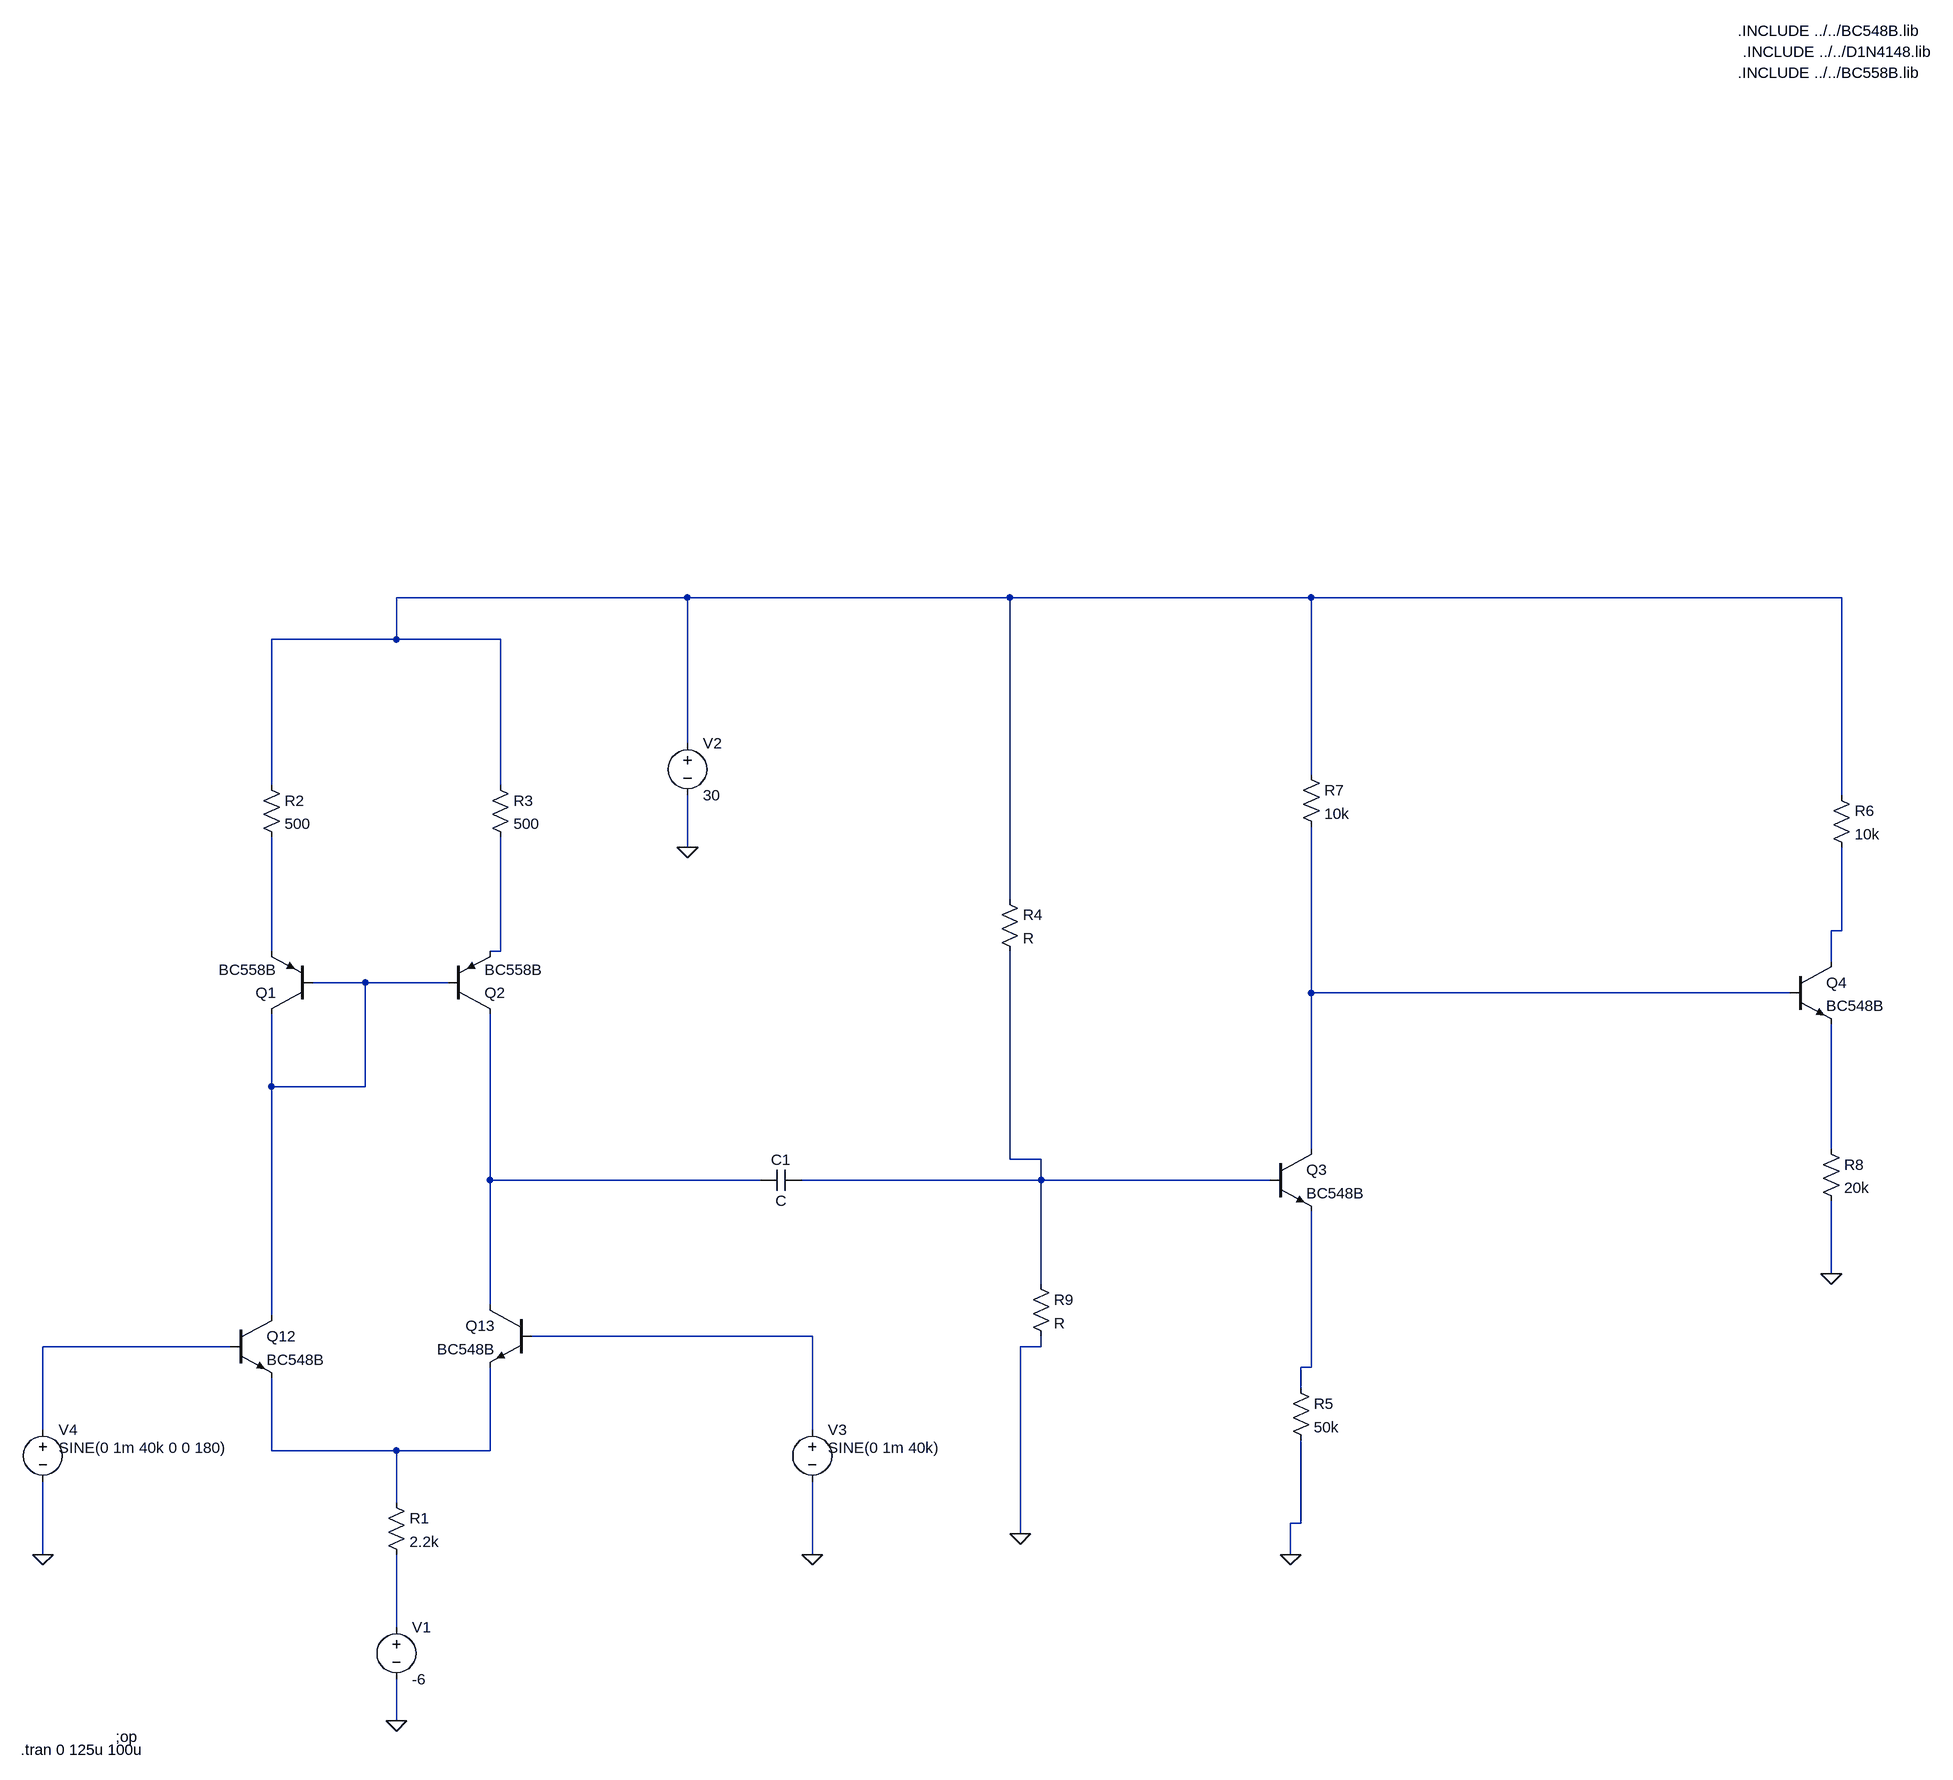
[diagram p0: schematic gm.asc]
gm.asc, the LTspice schematic file:
Version 4
SHEET 1 2512 1220
WIRE 576 -832 128 -832
WIRE 1072 -832 576 -832
WIRE 1536 -832 1072 -832
WIRE 2352 -832 1536 -832
WIRE 128 -768 128 -832
WIRE 128 -768 -64 -768
WIRE 288 -768 128 -768
WIRE 576 -608 576 -832
WIRE 1536 -560 1536 -832
WIRE -64 -544 -64 -768
WIRE 288 -544 288 -768
WIRE 2352 -528 2352 -832
WIRE 576 -448 576 -528
WIRE 1072 -368 1072 -832
WIRE 2352 -320 2352 -448
WIRE 2352 -320 2336 -320
WIRE -64 -288 -64 -464
WIRE 288 -288 288 -464
WIRE 288 -288 272 -288
WIRE 2336 -272 2336 -320
WIRE 80 -240 0 -240
WIRE 208 -240 80 -240
WIRE 1536 -224 1536 -480
WIRE 2272 -224 1536 -224
WIRE -64 -80 -64 -192
WIRE 80 -80 80 -240
WIRE 80 -80 -64 -80
WIRE 1536 16 1536 -224
WIRE 2336 16 2336 -176
WIRE 1072 32 1072 -288
WIRE 1120 32 1072 32
WIRE 272 64 272 -192
WIRE 688 64 272 64
WIRE 1120 64 1120 32
WIRE 1120 64 752 64
WIRE 1472 64 1120 64
WIRE 2336 208 2336 96
WIRE 1120 224 1120 64
WIRE 272 256 272 64
WIRE -64 272 -64 -80
WIRE 768 304 336 304
WIRE -128 320 -416 320
WIRE 1120 320 1120 304
WIRE 1120 320 1088 320
WIRE 1536 352 1536 112
WIRE 1536 352 1520 352
WIRE 1520 384 1520 352
WIRE -416 448 -416 320
WIRE 768 448 768 304
WIRE -64 480 -64 368
WIRE 128 480 -64 480
WIRE 272 480 272 352
WIRE 272 480 128 480
WIRE 128 560 128 480
WIRE 1520 592 1520 464
WIRE 1520 592 1504 592
WIRE 1088 608 1088 320
WIRE -416 640 -416 528
WIRE 768 640 768 528
WIRE 1504 640 1504 592
WIRE 128 752 128 640
WIRE 128 896 128 832
FLAG 128 896 0
FLAG 576 -448 0
FLAG 768 640 0
FLAG -416 640 0
FLAG 1504 640 0
FLAG 2336 208 0
FLAG 1088 608 0
SYMBOL pnp 0 -192 R180
SYMATTR InstName Q1
SYMATTR Value BC558B
SYMBOL pnp 208 -192 M180
SYMATTR InstName Q2
SYMATTR Value BC558B
SYMBOL res -80 -560 R0
SYMATTR InstName R2
SYMATTR Value 500
SYMBOL res 272 -560 R0
SYMATTR InstName R3
SYMATTR Value 500
SYMBOL res 112 544 R0
SYMATTR InstName R1
SYMATTR Value 2.2k
SYMBOL voltage 128 736 R0
WINDOW 123 0 0 Left 2
WINDOW 39 0 0 Left 2
SYMATTR InstName V1
SYMATTR Value -6
SYMBOL voltage 576 -624 R0
WINDOW 123 0 0 Left 2
WINDOW 39 0 0 Left 2
SYMATTR InstName V2
SYMATTR Value 30
SYMBOL npn 336 256 M0
SYMATTR InstName Q13
SYMATTR Value BC548B
SYMBOL npn -128 272 R0
SYMATTR InstName Q12
SYMATTR Value BC548B
SYMBOL voltage 768 432 R0
WINDOW 123 24 124 Left 2
WINDOW 39 0 0 Left 2
WINDOW 3 24 44 Left 2
SYMATTR InstName V3
SYMATTR Value SINE(0 1m 40k)
SYMBOL voltage -416 432 R0
WINDOW 123 24 124 Left 2
WINDOW 39 0 0 Left 2
WINDOW 3 24 44 Left 2
SYMATTR InstName V4
SYMATTR Value SINE(0 1m 40k 0 0 180)
SYMBOL npn 1472 16 R0
SYMATTR InstName Q3
SYMATTR Value BC548B
SYMBOL npn 2272 -272 R0
SYMATTR InstName Q4
SYMATTR Value BC548B
SYMBOL res 1504 368 R0
SYMATTR InstName R5
SYMATTR Value 50k
SYMBOL res 2336 -544 R0
SYMATTR InstName R6
SYMATTR Value 10k
SYMBOL res 1520 -576 R0
SYMATTR InstName R7
SYMATTR Value 10k
SYMBOL res 2320 0 R0
SYMATTR InstName R8
SYMATTR Value 20k
SYMBOL cap 752 48 R90
WINDOW 0 0 32 VBottom 2
WINDOW 3 32 32 VTop 2
SYMATTR InstName C1
SYMBOL res 1056 -384 R0
SYMATTR InstName R4
SYMBOL res 1104 208 R0
SYMATTR InstName R9
TEXT 2192 -1704 Left 2 !.INCLUDE ../../BC548B.lib
TEXT 2200 -1672 Left 2 !.INCLUDE ../../D1N4148.lib
TEXT 2192 -1640 Left 2 !.INCLUDE ../../BC558B.lib
TEXT -304 920 Left 2 !;op
TEXT -450 940 Left 2 !.tran 0 125u 100u

The netlist it stands for:
* gm.asc
Q1 N005 N005 N003 0 BC558B
Q2 N009 N005 N004 0 BC558B
R2 N001 N003 500
R3 N001 N004 500
R1 N013 N014 2.2k
V1 N014 0 -6
V2 N001 0 30
Q13 N009 N010 N013 0 BC548B
Q12 N005 N011 N013 0 BC548B
V3 N010 0 SINE(0 1m 40k)
V4 N011 0 SINE(0 1m 40k 0 0 180)
Q3 N006 N008 N012 0 BC548B
Q4 N002 N006 N007 0 BC548B
R5 N012 0 50k
R6 N001 N002 10k
R7 N001 N006 10k
R8 N007 0 20k
C1 N008 N009 C
R4 N001 N008 R
R9 N008 0 R
.model NPN NPN
.model PNP PNP
.lib standard.bjt
.INCLUDE ../../BC548B.lib
.INCLUDE ../../D1N4148.lib
.INCLUDE ../../BC558B.lib
;op
.tran 0 125u 100u
.backanno
.end